# EAGLE board APM_v252_RELEASE (EAGLE 6.3)
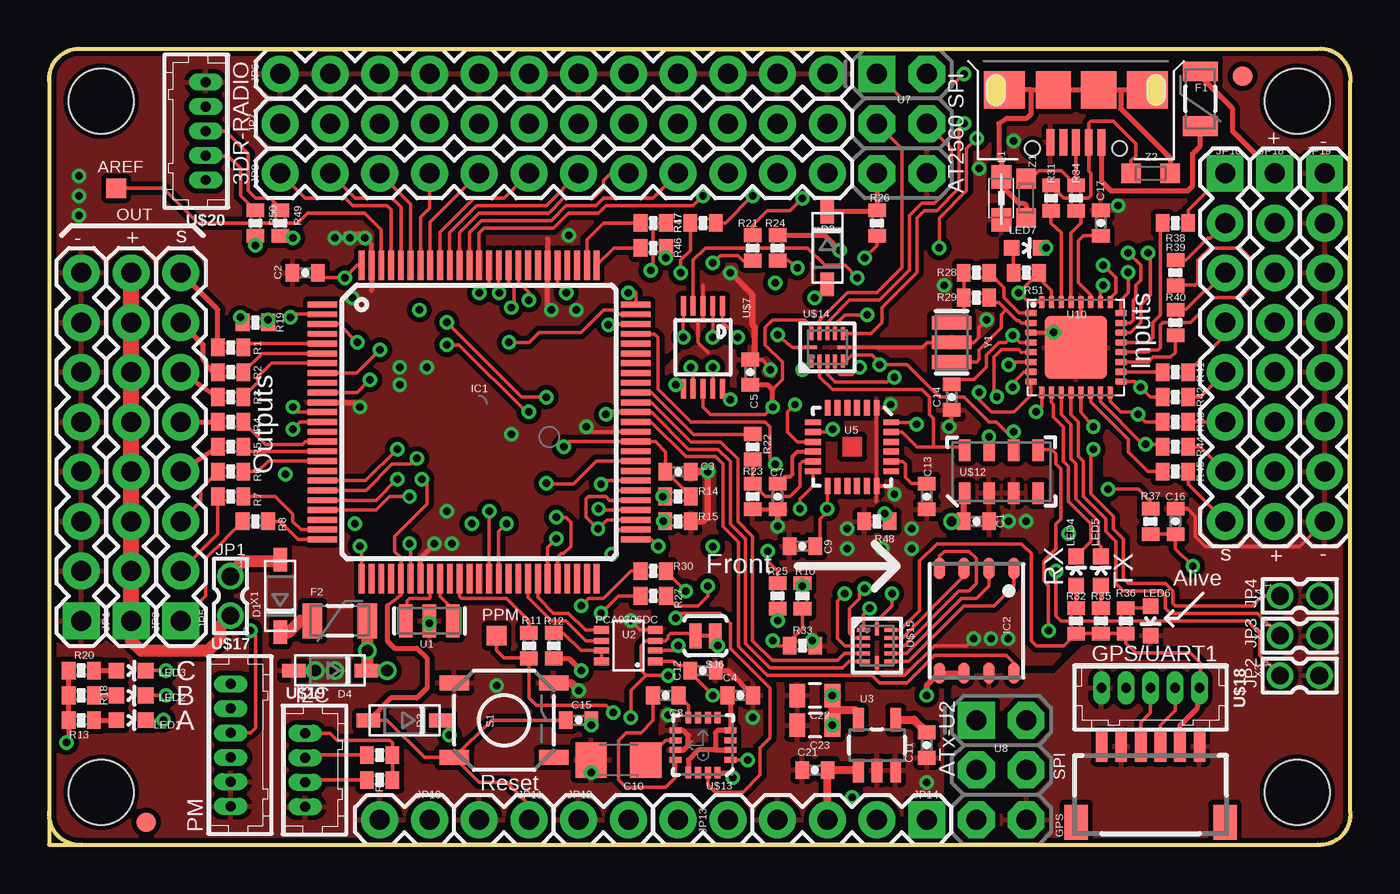
[diagram p1: board, top side]
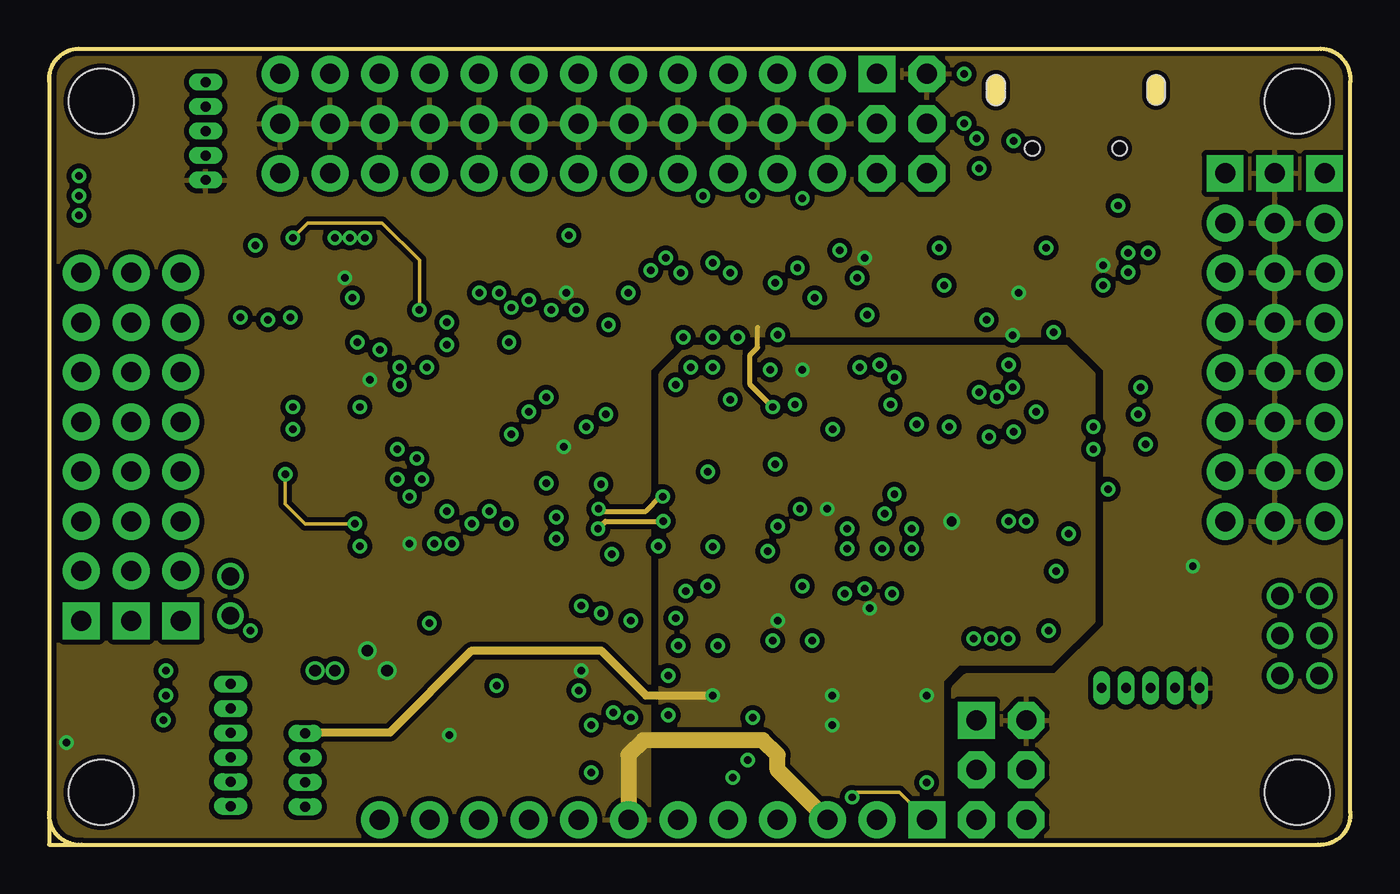
[diagram p2: board, inner layer Route2]
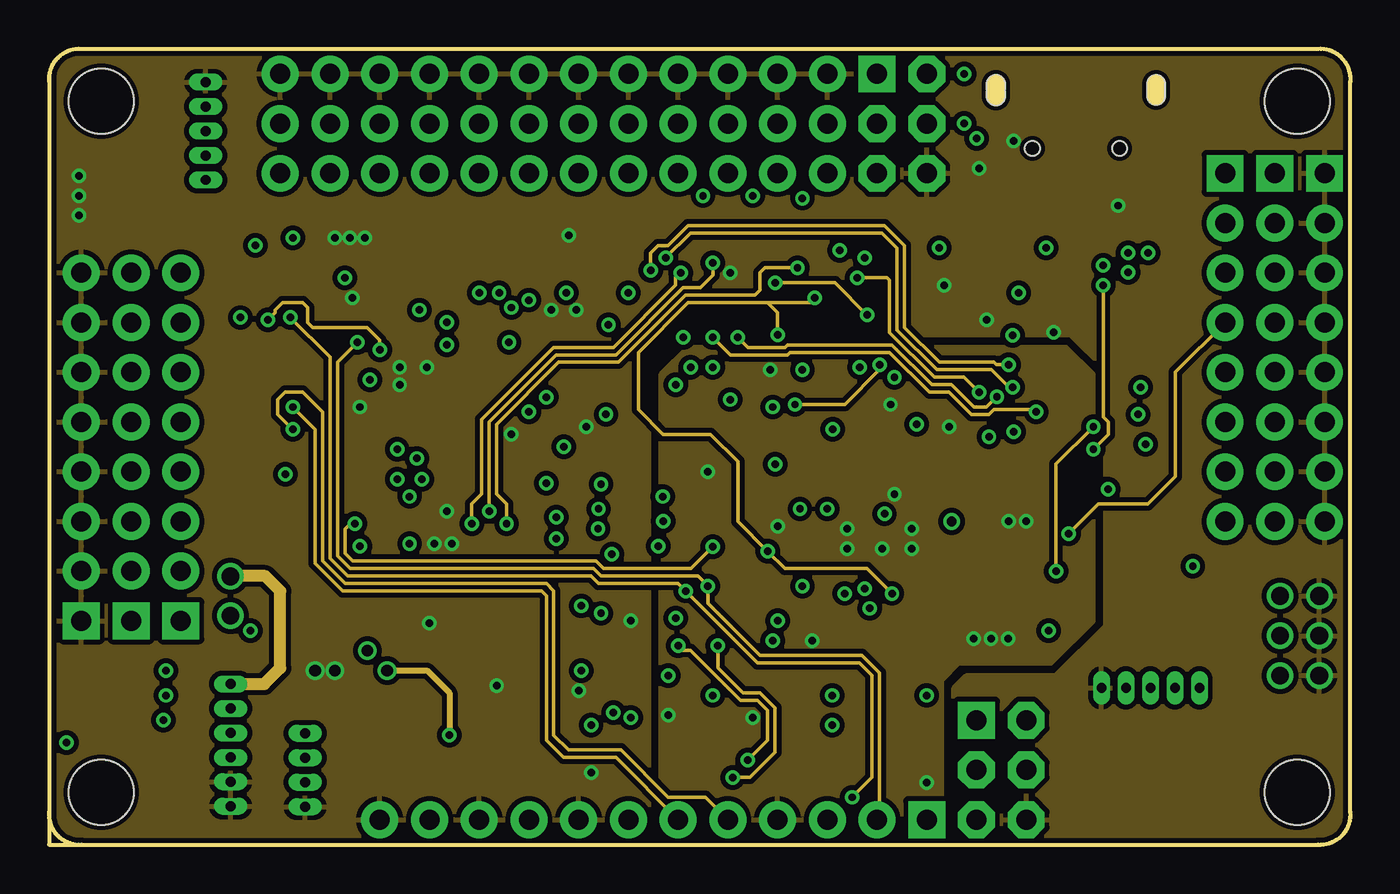
[diagram p3: board, inner layer Route15]
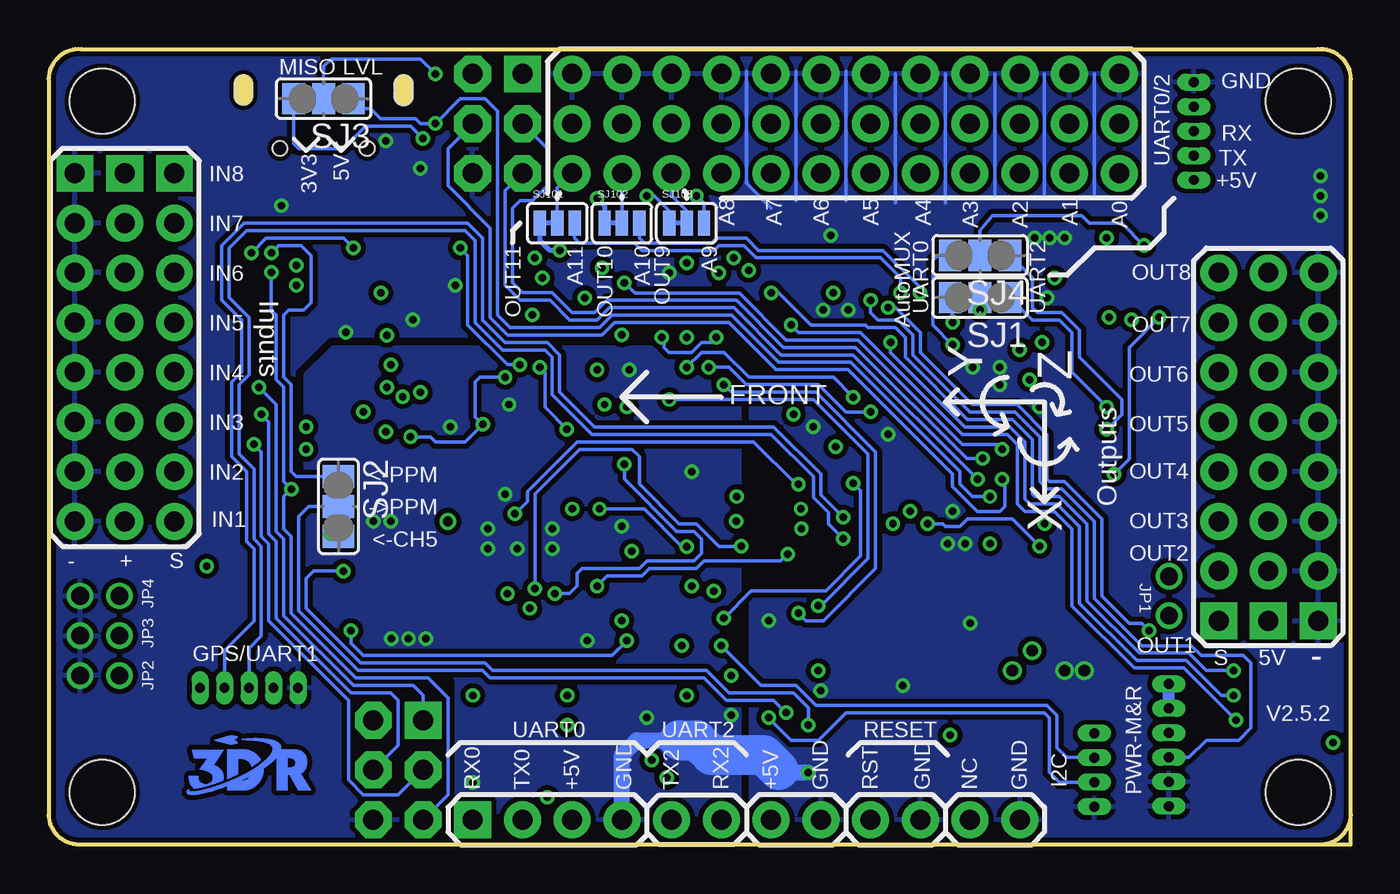
[diagram p4: board, bottom side, seen from below]

Size 66.48 x 40.65 mm. Coordinates in mm from the lower left corner, seen from the top.
Outline: 1.66,0 0,0 0,38.99
Outline: 1.66,0 64.83,0
Outline: 0,39.25 0,38.99
Outline: 1.4,40.64 64.83,40.64 arc-99 66.48,38.98 66.48,1.66 arc-99 64.82,0
Outline: 1.67,40.64 arc99 0,38.99
Outline: 0,1.67 arc99 1.66,0
Copper layers (1*2*15*16): Top 0.035mm / dielectric 0.5mm / Route2 0.035mm / dielectric 0.5mm / Route15 0.035mm / dielectric 0.5mm / Bottom 0.035mm
Design rules "default": minimum track width 7mil, minimum drill 10mil, track to track 7mil, track to pad 7mil, pad to pad 7mil, via to via 7mil, smd to smd 0mil, copper to edge 10mil, drill to drill 8mil, minimum pad ring 7mil, minimum via ring 7mil, stop-mask expansion 4mil, vias tented up to drill 25mil, thermal gap 10mil
Net classes: 0 default: width 0.178 mm, drill 0.381 mm, clearance 0.178 mm
Holes 0.9 mm at 48.37,38.87 48.37,38.23 48.37,38.43 48.37,38.66 56.55,38.87 56.55,38.26 56.55,38.46 56.55,38.66

## Footprints (pad centres in the part's own frame; a part is rotated, then mirrored left to right if it is on the bottom)
0402-CAP = smd 0.7 x 0.9: 1 -0.65,0; 2 0.65,0
1206 = smd 1.6 x 1.8: 1 -1.4,0; 2 1.4,0
0805 = smd 0.8 x 1.2: 1 -0.9,0; 2 0.9,0
SOD-123 = smd 1.2 x 0.7: A 1.85,0; C -1.85,0
PTC-1206 = smd 1 x 1.8: 1 -1.4,0; 2 1.4,0
SM06B-SRSS-TB = smd 0.6 x 1.55: 1 -2.5,2.975; 2 -1.5,2.975; 3 -0.5,2.975; 4 0.5,2.975; 5 1.5,2.975; 6 2.5,2.975 | smd 1.2 x 1.8: FIT@1 -3.8,-0.9; FIT@2 3.8,-0.9
TQFP100 = smd 1.5 x 0.3: 1 -8,6; 2 -8,5.5; 3 -8,5; 4 -8,4.5; 5 -8,4; 6 -8,3.5; 7 -8,3; 8 -8,2.5; 9 -8,2; 10 -8,1.5; 11 -8,1; 12 -8,0.5; 13 -8,0; 14 -8,-0.5; 15 -8,-1; 16 -8,-1.5; 17 -8,-2; 18 -8,-2.5; 19 -8,-3; 20 -8,-3.5; 21 -8,-4; 22 -8,-4.5; 23 -8,-5; 24 -8,-5.5; 25 -8,-6; 51 8,-6; 52 8,-5.5; 53 8,-5; 54 8,-4.5; 55 8,-4; 56 8,-3.5; 57 8,-3; 58 8,-2.5; 59 8,-2; 60 8,-1.5; 61 8,-1; 62 8,-0.5; 63 8,0; 64 8,0.5; 65 8,1; 66 8,1.5; 67 8,2; 68 8,2.5; 69 8,3; 70 8,3.5; 71 8,4; 72 8,4.5; 73 8,5; 74 8,5.5; 75 8,6 | smd 0.3 x 1.5: 26 -6,-8; 27 -5.5,-8; 28 -5,-8; 29 -4.5,-8; 30 -4,-8; 31 -3.5,-8; 32 -3,-8; 33 -2.5,-8; 34 -2,-8; 35 -1.5,-8; 36 -1,-8; 37 -0.5,-8; 38 0,-8; 39 0.5,-8; 40 1,-8; 41 1.5,-8; 42 2,-8; 43 2.5,-8; 44 3,-8; 45 3.5,-8; 46 4,-8; 47 4.5,-8; 48 5,-8; 49 5.5,-8; 50 6,-8; 76 6,8; 77 5.5,8; 78 5,8; 79 4.5,8; 80 4,8; 81 3.5,8; 82 3,8; 83 2.5,8; 84 2,8; 85 1.5,8; 86 1,8; 87 0.5,8; 88 0,8; 89 -0.5,8; 90 -1,8; 91 -1.5,8; 92 -2,8; 93 -2.5,8; 94 -3,8; 95 -3.5,8; 96 -4,8; 97 -4.5,8; 98 -5,8; 99 -5.5,8; 100 -6,8
VDFN-8-NO-BOTTOM-PAD = smd 1.1 x 0.6: 1 -2.675,1.905; 2 -2.675,0.635; 3 -2.675,-0.635; 4 -2.675,-1.905; 5 2.675,-1.905; 6 2.675,-0.635; 7 2.675,0.635; 8 2.675,1.905
1X08 = drill 1.016 pad 1.88 square: 1 0,0 | drill 1.016 pad 1.88: 2 2.54,0; 3 5.08,0; 4 7.62,0; 5 10.16,0; 6 12.7,0; 7 15.24,0; 8 17.78,0
FIDUCIAL-1X2 = smd 1 x 1: 1 0,0
1X12 = drill 1.016 pad 1.88: 1 0,0; 2 2.54,0; 3 5.08,0; 4 7.62,0; 5 10.16,0; 6 12.7,0; 7 15.24,0; 8 17.78,0; 9 20.32,0; 10 22.86,0; 11 25.4,0; 12 27.94,0
1X02 = drill 1.016 pad 1.88: 1 0,0; 2 2.54,0
1X04 = drill 1.016 pad 1.88 square: 1 0,0 | drill 1.016 pad 1.88: 2 2.54,0; 3 5.08,0; 4 7.62,0
0805' = smd 1.2 x 1: 1 -1.1,0; 2 1.1,0
LED-0603 = smd 0.8 x 0.8: A 0,-0.75; C 0,0.75
0402-RES = smd 0.7 x 0.9: 1 -0.65,0; 2 0.65,0
TACTILE_SWITCH_SMD = smd 1.524 x 0.762: 1 -2.54,1.905; 2 2.54,1.905; 3 -2.54,-1.905; 4 2.54,-1.905
SJ_2 = smd 1.168 x 1.6: 1 -1.524,0; 2 0,0; 3 1.524,0
SJ_2S-TRACE = smd 0.635 x 1.27: 1 -0.508,0; 2 0.508,0
SJ_3 = smd 0.635 x 1.27: 1 -0.889,0; 2 0,0; 3 0.889,0
TP10SQ = smd 1 x 1: TP 0,0
RESONATOR-SMD = smd 0.7 x 1.7: 1 -1.2,0; 2 0,0; 3 1.2,0
VSSOP8 = smd 0.75 x 0.4: 1 -1.375,0.8; 4 -1.375,-0.8; 5 1.375,-0.8; 8 1.375,0.8 | smd 0.75 x 0.3: 2 -1.375,0.25; 3 -1.375,-0.25; 6 1.375,-0.25; 7 1.375,0.25
SOT23-5 = smd 0.55 x 1.2: 1 -0.95,-1.3; 2 0,-1.3; 3 0.95,-1.3; 4 0.95,1.3; 5 -0.95,1.3
QFN-24 = smd 0.8 x 0.3: 1 -2,1.25; 2 -2,0.75; 3 -2,0.25; 4 -2,-0.25; 5 -2,-0.75; 6 -2,-1.25; 13 2,-1.25; 14 2,-0.75; 15 2,-0.25; 16 2,0.25; 17 2,0.75; 18 2,1.25 | smd 0.3 x 0.8: 7 -1.25,-2; 8 -0.75,-2; 9 -0.25,-2; 10 0.25,-2; 11 0.75,-2; 12 1.25,-2; 19 1.25,2; 20 0.75,2; 21 0.25,2; 22 -0.25,2; 23 -0.75,2; 24 -1.25,2
2X3-NS = drill 1.016 pad 1.88 square: 1 -2.54,-1.27 | drill 1.016 pad 1.88 octagon: 2 -2.54,1.27; 3 0,-1.27; 4 0,1.27; 5 2.54,-1.27; 6 2.54,1.27
MOLEX_MICRO_USB_AB_BOTTOM_MOUNT = smd 0.4 x 1.35: 1 1.3,-4.125; 2 0.65,-4.125; 3 0,-4.125; 4 -0.65,-4.125; 5 -1.3,-4.125 | smd 2.1 x 1.9: GND1 3.65,-1.452; GND4 -3.65,-1.452 | smd 1.8 x 1.9: GND2 1.151,-1.452; GND3 -1.149,-1.452 | hole 0.75: -2.225,-4.45; 2.225,-4.45
QFN32 = smd 0.6 x 0.3: 1 -2.3,1.75; 2 -2.3,1.25; 3 -2.3,0.75; 4 -2.3,0.25; 5 -2.3,-0.25; 6 -2.3,-0.75; 7 -2.3,-1.25; 8 -2.3,-1.75; 17 2.3,-1.75; 18 2.3,-1.25; 19 2.3,-0.75; 20 2.3,-0.25; 21 2.3,0.25; 22 2.3,0.75; 23 2.3,1.25; 24 2.3,1.75 | smd 0.3 x 0.6: 9 -1.75,-2.3; 10 -1.25,-2.3; 11 -0.75,-2.3; 12 -0.25,-2.3; 13 0.25,-2.3; 14 0.75,-2.3; 15 1.25,-2.3; 16 1.75,-2.3; 25 1.75,2.3; 26 1.25,2.3; 27 0.75,2.3; 28 0.25,2.3; 29 -0.25,2.3; 30 -0.75,2.3; 31 -1.25,2.3; 32 -1.75,2.3 | smd 3.2 x 3.2: EXP 0,0
STAND-OFF = hole 3.302: 0,0
MSOP10 = smd 0.25 x 1: 1 -1,-2.113; 2 -0.5,-2.113; 3 0,-2.113; 4 0.5,-2.113; 5 1,-2.113; 6 1,2.113; 7 0.5,2.113; 8 0,2.113; 9 -0.5,2.113; 10 -1,2.113
MS5611-01BA = smd 1.1 x 0.6: 1 -1.1,1.875; 2 -1.1,0.625; 3 -1.1,-0.625; 4 -1.1,-1.875; 5 1.1,-1.875; 6 1.1,-0.625; 7 1.1,0.625; 8 1.1,1.875
LPCC16 = smd 0.6 x 0.3: 1 -1.4,0.75; 2 -1.4,0.25; 3 -1.4,-0.25; 4 -1.4,-0.75; 9 1.4,-0.75; 10 1.4,-0.25; 11 1.4,0.25; 12 1.4,0.75 | smd 0.3 x 0.6: 5 -0.75,-1.4; 6 -0.25,-1.4; 7 0.25,-1.4; 8 0.75,-1.4; 13 0.75,1.4; 14 0.25,1.4; 15 -0.25,1.4; 16 -0.75,1.4
UQFN-12 = smd 0.2 x 0.65: 1 -0.8,-0.7; 2 -0.4,-0.7; 3 0,-0.7; 4 0.4,-0.7; 5 0.8,-0.7; 7 0.8,0.7; 8 0.4,0.7; 9 0,0.7; 10 -0.4,0.7; 11 -0.8,0.7 | smd 0.65 x 0.2: 6 0.85,0; 12 -0.85,0
DF13-6P-1.25DSA = drill 0.5 pad 0.8 long: 1 -3.125,0; 2 -1.875,0; 3 -0.625,0; 4 0.625,0; 5 1.875,0; 6 3.125,0
DF13-5P-1.25DSA = drill 0.5 pad 0.8 long: 1 -2.5,0; 2 -1.25,0; 3 0,0; 4 1.25,0; 5 2.5,0
DF13-4P-1.25DSA = drill 0.5 pad 0.8 long: 1 -1.875,0; 2 -0.625,0; 3 0.625,0; 4 1.875,0
87758-0216 = drill 0.9 pad 1.27: 1 0,-1; 2 0,1
RESONATOR = smd 0.7 x 2: 1 -1,0; 2 0,0; 3 1,0
CT/CN0603 = smd 1 x 1: 1 -1,0; 2 1,0

## Placement (x,y rotation side)
C1  .1uF  [0402-CAP]  47.38,16.51 180 top
C2  .1uF  [0402-CAP]  13.09,29.21 180 top
C3  .1uF  [0402-CAP]  32.14,19.05 0 top
C4  0.1uF  [0402-CAP]  35.31,7.62 0 top
C5  .1uF  [0402-CAP]  35.82,24.13 270 top
C7  .1uF  [0402-CAP]  37.22,17.78 90 top
C8  0.22uF  [0402-CAP]  31.5,7.62 180 top
C9  .1uF  [0402-CAP]  38.49,15.24 0 top
C10  4.7uF  [1206]  29.09,4.32 180 top
C11  .01uF  [0402-CAP]  44.84,5.08 90 top
C12  .1uF  [0402-CAP]  33.41,8.89 180 top
C13  .01uF  [0402-CAP]  44.84,17.78 90 top
C14  .1uF  [0402-CAP]  46.11,22.86 270 top
C15  .1uF  [0402-CAP]  27.06,6.35 180 top
C16  .1uF  [0402-CAP]  57.54,16.51 90 top
C17  1uF  [0402-CAP]  53.73,31.75 90 top
C21  .1uF  [0402-CAP]  39.12,3.81 0 top
C22  4.7uF  [0805]  39.12,7.62 180 top
C23  4.7uF  [0805]  39.12,6.1 180 top
D1  MBR120VLSFT1G  [SOD-123]  11.82,12.7 90 top
D2  MBR120VLSFT1G  [SOD-123]  39.76,30.48 270 top
D3  MBR120VLSFT1G  [SOD-123]  18.17,6.35 180 top
D4  MMSZ5233BT1G  [SOD-123]  14.36,8.89 180 top
F1  500mA  [PTC-1206]  58.81,38.1 90 top
F2  500mA  [PTC-1206]  14.86,11.43 0 top
GPS  SM06B-SRSS-TB  [SM06B-SRSS-TB]  56.27,2.04 0 top
IC1  ATMEGA2560-16AU  [TQFP100]  21.98,21.59 0 top
IC2  AT45DB161D-MU  [VDFN-8-NO-BOTTOM-PAD]  47.38,11.43 270 top
JP1  GND  [1X08]  1.66,11.43 90 top
JP2  FIDUCIAL1X2  [FIDUCIAL-1X2]  4.96,1.15 0 top
JP3  5V  [1X08]  4.2,11.43 90 top
JP5  OUT PWM  [1X08]  6.74,11.43 90 top
JP6  GND  [1X12]  11.82,39.37 0 top
JP7  5V  [1X12]  11.82,36.83 0 top
JP8  IO pins  [1X12]  11.82,34.29 0 top
JP10  3v3  [1X02]  19.44,1.27 180 top
JP11  RST  [1X02]  24.52,1.27 180 top
JP12  VCC  [1X02]  27.06,1.27 0 top
JP13  UART2  [1X02]  34.68,1.27 180 top
JP14  UART0  [1X04]  44.84,1.27 180 top
JP16  IN PWM  [1X08]  60.08,34.29 270 top
JP17  FIDUCIAL1X2  [FIDUCIAL-1X2]  60.96,39.25 0 top
JP18  5V  [1X08]  62.62,34.29 270 top
JP19  GND  [1X08]  65.16,34.29 270 top
L1  BLM21  [0805']  48.65,33.02 90 top
LED1  RED  [LED-0603]  4.2,6.35 270 top
LED2  YELLOW  [LED-0603]  4.2,7.62 270 top
LED3  BLUE  [LED-0603]  4.2,8.89 270 top
LED4  ORANGE  [LED-0603]  52.46,13.97 0 top
LED5  ORANGE  [LED-0603]  53.73,13.97 0 top
LED6  GRN  [LED-0603]  56.27,11.43 180 top
LED7  RED  [LED-0603]  49.92,30.48 270 top
R1  220  [0402-RES]  9.28,25.4 0 top
R2  220  [0402-RES]  9.28,24.13 0 top
R3  220  [0402-RES]  9.28,22.86 0 top
R4  220  [0402-RES]  9.28,21.59 0 top
R5  220  [0402-RES]  9.28,20.32 0 top
R6  220  [0402-RES]  9.28,19.05 0 top
R7  220  [0402-RES]  9.28,17.78 0 top
R8  220  [0402-RES]  10.55,16.51 0 top
R9  2.2k  [0402-RES]  16.9,4.58 0 top
R10  4.7K  [0402-RES]  38.49,12.7 90 top
R11  1K  [0402-RES]  24.52,10.16 270 top
R12  200k  [0402-RES]  25.79,10.16 270 top
R13  1k  [0402-RES]  1.66,6.35 180 top
R14  10K  [0402-RES]  32.14,17.78 180 top
R15  10K  [0402-RES]  32.14,16.51 180 top
R16  2.2k  [0402-RES]  16.9,3.31 0 top
R17  1k  [0402-RES]  33.41,31.75 0 top
R18  1k  [0402-RES]  1.66,7.62 180 top
R19  220  [0402-RES]  10.55,26.67 0 top
R20  1k  [0402-RES]  1.66,8.89 180 top
R21  1k  [0402-RES]  35.95,30.48 90 top
R22  4.7K  [0402-RES]  35.95,20.32 90 top
R23  10k  [0402-RES]  35.95,17.78 270 top
R24  1k  [0402-RES]  37.22,30.48 90 top
R25  10k  [0402-RES]  37.22,12.7 90 top
R26  10k  [0402-RES]  42.3,31.75 270 top
R27  1k  [0402-RES]  30.87,12.7 180 top
R28  27  [0402-RES]  47.38,29.21 0 top
R29  1M  [0402-RES]  47.38,27.94 180 top
R30  1k  [0402-RES]  30.87,13.97 180 top
R31  22  [0402-RES]  51.19,33.02 90 top
R32  1k  [0402-RES]  52.46,11.43 90 top
R33  10k  [0402-RES]  38.49,10.16 0 top
R34  22  [0402-RES]  52.46,33.02 90 top
R35  1k  [0402-RES]  53.73,11.43 90 top
R36  1k  [0402-RES]  55,11.43 270 top
R37  10K  [0402-RES]  56.27,16.51 270 top
R38  220  [0402-RES]  57.54,31.75 180 top
R39  220  [0402-RES]  57.54,29.21 270 top
R40  220  [0402-RES]  57.54,26.67 270 top
R41  220  [0402-RES]  57.54,24.13 180 top
R42  220  [0402-RES]  57.54,22.86 180 top
R43  220  [0402-RES]  57.54,21.59 180 top
R44  220  [0402-RES]  57.54,20.32 180 top
R45  220  [0402-RES]  57.54,19.05 180 top
R46  1k  [0402-RES]  30.87,30.48 0 top
R47  1k  [0402-RES]  30.87,31.75 0 top
R48  10k  [0402-RES]  42.3,16.51 180 top
R49  1k  [0402-RES]  11.82,31.75 270 top
R50  1k  [0402-RES]  10.55,31.75 270 top
R51  1k  [0402-RES]  49.92,29.21 180 top
S1  [TACTILE_SWITCH_SMD]  23.25,6.35 0 top
SJ1  [SJ_2]  18.93,27.94 180 bottom
SJ2  [SJ_2]  51.69,17.28 270 bottom
SJ3  [SJ_2]  52.46,38.1 180 bottom
SJ4  [SJ_2]  18.93,30.1 180 bottom
SJ6  MAG  [SJ_2S-TRACE]  33.53,10.67 180 top
SJ101  [SJ_3]  40.52,31.75 0 bottom
SJ102  [SJ_3]  37.22,31.75 0 bottom
SJ103  [SJ_3]  33.91,31.75 0 bottom
TP1  TPSQTP10SQ  [TP10SQ]  3.43,33.53 0 top
TP2  TPSQTP10SQ  [TP10SQ]  22.86,10.67 0 top
U1  16MHZ  [RESONATOR-SMD]  19.44,11.43 0 top
U2  PCA9306DC  [VSSOP8]  29.6,10.16 180 top
U3  TPS79133  [SOT23-5]  42.3,5.08 0 top
U5  MPU-6000  [QFN-24]  41.03,20.32 270 top
U7  SPI_Mega  [2X3-NS]  43.57,36.83 270 top
U8  SPI_PPM  [2X3-NS]  48.65,3.81 270 top
U9  USB  [MOLEX_MICRO_USB_AB_BOTTOM_MOUNT]  52.46,40.01 0 top
U10  ATMEGA32U2-MU  [QFN32]  52.46,25.4 0 top
U$1  STAND-OFF  [STAND-OFF]  2.67,37.98 0 top
U$2  STAND-OFF  [STAND-OFF]  2.67,2.67 0 top
U$4  STAND-OFF  [STAND-OFF]  63.76,37.98 0 top
U$5  STAND-OFF  [STAND-OFF]  63.76,2.67 0 top
U$6  CREATIVE_COMMONS  [CREATIVE_COMMONS]  64.65,-8.38 180 top  (outside the outline)
U$7  TS5A23157  [MSOP10]  33.41,25.4 180 top
U$12  MS5611-01BA  [MS5611-01BA]  48.65,19.05 90 top
U$13  HMC5883L  [LPCC16]  33.41,5.08 180 top
U$14  TXB0104UQFN  [UQFN-12]  39.76,25.4 0 top
U$15  TXB0104UQFN  [UQFN-12]  42.3,10.16 270 top
U$17  DF13-6P-1.25DSA  [DF13-6P-1.25DSA]  9.28,5.08 270 top
U$18  DF13-5P-1.25DSA  [DF13-5P-1.25DSA]  56.27,8.01 180 top
U$19  DF13-4P-1.25DSA  [DF13-4P-1.25DSA]  13.09,3.81 270 top
U$20  DF13-5P-1.25DSA  [DF13-5P-1.25DSA]  8.01,36.45 90 top
U$21  [3DR-LOGO-025IN-METAL]  56.27,3.81 0 bottom
X1  ESC 5V EN  [87758-0216]  9.28,12.7 180 top
X2  PPM_PD6  [87758-0216]  63.89,10.67 270 top
X3  HWB  [87758-0216]  63.89,8.64 270 top
X4  PPM_PC4  [87758-0216]  63.89,12.7 270 top
Y1  16MHz  [RESONATOR]  46.11,25.66 90 top
Z1  PGB1010604  [CT/CN0603]  49.92,33.02 270 top
Z2  PGB1010604  [CT/CN0603]  56.27,34.29 0 top

## Tracks (layer width: path | path; a pad name or v marks a point on that pad's centre or on a via)
3.3V  (via drill 0.38, 0.5)
  Top 0.178: U2.1 31.92,9.36 32.14,9.15 32.5,9.15 C12.2 32.76,8.78 v33.91,7.62 | U5.13 39.78,17.26 v39.76,17.15 | v39.76,17.15 39.76,17.02 39.37,16.64 39.37,15.5 39.11,15.23 C9.2 | v37.22,11.43 R25.1 | v39.76,17.15 39.74,17.15 | U$14.1 38.93,24.7 v38.49,24.26 | U$15.1 41.6,11.75 v41.91,12.07 | R16.2 R9.2 17.55,5.2 17.4,5.34 14.71,5.34 14.36,5.69 U$19.1
  Top 0.254: v33.91,7.62 C4.1 34.81,7.48 U$13.4 34.16,5.83 34.04,5.72 34.04,4.83 | 34.04,4.83 33.16,4.83 32.66,4.33 U$13.13 | 34.04,4.83 U$13.2
  Top 0.305: U$12.1 46.73,17.91 C1.2 | v44.84,7.62 44.84,8.12 IC2.5 IC2.6
  Top 0.406: v46.11,16.51 C1.2 | 40.02,6.99 C23.1 v40.01,6.1 | 40.02,6.99 C22.1 | 40.02,6.99 40.05,7.02 40.05,6.95 40.14,6.86 41.19,6.86 41.35,6.71 U3.5
  Route2 0.406: v33.91,7.62 30.48,7.62 28.2,9.91 21.59,9.91 17.4,5.72 13.12,5.72 U$19.1
  other vias: 40.01,7.62
  pour Route2 (isolate 0.254): 45.6,-4.44 45.6,8.39 46.49,9.28 51.19,9.28 53.34,11.43 53.34,24.01 51.95,25.4 32.64,25.4 31.25,24.01 31.25,-4.44
5V
  Top 0.254: 4.32,12.7 4.2,12.83
  Top 0.61: JP3.1 4.2,10.42 4.7,9.91 8.13,9.91 8.77,10.55 8.77,11.2 X1.2
  Top 0.813: JP3.1 4.2,12.83 JP3.2 JP3.3 JP3.4 JP3.5 JP3.6 JP3.7 JP3.8
#RST  (via drill 0.38)
  Top 0.178: U10.13 52.71,22.11 v53.34,21.34 | v51.44,13.97 51.44,11.69 51.69,11.43 61.22,11.43 61.85,10.8 61.85,9.67 X3.1
  Top 0.406: C15.1 27.71,6.12 v27.69,6.1
  Route15 0.178: v53.34,21.34 51.44,19.44 v51.44,13.97
  Bottom 0.178: v27.69,6.1 27.69,6.99 28.45,7.75 31.75,7.75 32.9,8.89 43.82,8.89 44.2,9.28 50.55,9.28 53.34,12.07 53.34,13.59 52.96,13.97 v51.44,13.97
AREF
  Top 0.178: IC1.98 16.98,31.42 16.13,32.26 13.21,32.26 12.7,31.75 7.62,31.75 5.85,33.53 TP1.TP
CH1
  Top 0.178: R45.1 58.19,18.4 JP16.8
CH5  (via drill 0.38)
  Top 0.178: JP16.4 60.08,26.04 58.19,24.15 R41.1
  Route15 0.178: JP16.4 57.54,24.13 57.54,18.8 56.14,17.4 53.6,17.4 v52.07,15.88
  Bottom 0.178: SJ2.3 52.2,15.75 v52.07,15.88
CH8
  Top 0.178: JP16.1 58.19,32.4 R38.1
CS_DF
  Top 0.178: U$15.9 43.69,10.16 46.49,12.96 46.99,12.96 47.38,13.34 47.38,14.61 46.99,14.99 45.72,14.99 45.47,14.74 IC2.4
CS_MS5611  (via drill 0.38)
  Top 0.178: U$12.5 50.55,20.18 51.2,20.18 51.44,19.94 51.44,19.44 51.69,19.18 51.69,16.64 51.44,16.39 51.44,15.12 50.8,14.48 50.8,13.47 51.06,13.21 v51.06,10.93 | 38.5,12.07 R10.1 38.49,11.05 37.85,10.42 R33.1 37.22,10.16 v36.96,10.42
  Bottom 0.178: v51.06,10.93 51.06,10.29 50.42,9.66 37.72,9.66 v36.96,10.42
D+
  Top 0.178: Z1.1 50.15,34.02 50.55,34.42 51.71,34.42 R34.2 U9.3
D-
  Top 0.178: R31.2 51.84,33.02 53.09,33.02 53.22,33.15 53.22,34.29 53.11,34.41 U9.2 53.11,36.85 53.22,36.96 54.36,36.96 55.5,35.82 55.5,35.18 55.27,34.95 Z2.1
FSYNC
  Top 0.178: U5.11 38.5,19.57 38.36,19.44 38.36,18.29 37.85,17.78 36.6,17.78 R23.1 R22.1
GND  (via drill 0.38, 0.6)
  Top 0.178: IC1.62 27.69,21.09 v27.44,21.34 | U10.3 v51.32,26.15 | 51.95,25.91 51.71,26.15 v51.32,26.15 | 51.95,25.91 U10.EXP | v51.32,26.15 v51.31,26.17 | U1.2 v19.44,11.31 | U5.1 U5.18 42.77,18.32 v43.18,17.91 | R23.2 C7.1 | C16.2 58.16,17.16 58.55,16.77 58.55,15.75 59.06,15.24 63.89,15.24 JP19.8 | C5.1 36.44,24.78 v36.83,24.26 | U$7.3 33.41,26.93 33.15,26.67 33.15,25.66 33.66,25.15 | 16.48,30.65 v16.13,30.99 15.88,31.25 15.12,31.25 | C14.2 46.11,21.59 v45.98,21.34 | U2.4 30.19,10.96 v29.72,11.43 | U$15.6 42.3,8.89 42.55,8.64 43.69,8.64 45.22,10.16 46.87,10.16 47.25,10.55 | U$14.6 44.58,25.4 44.84,25.66 Y1.2 47.25,25.66 47.5,25.91 47.5,26.42 v47.88,26.8 47.76,26.67 | R33.2 39.14,10.28 v38.99,10.42 | U10.28 52.71,26.67 51.95,25.91 | 33.41,27.69 33.41,28.58 | 42.27,18.24 42.27,17.56 42.24,17.53
  Top 0.254: IC1.11 15.61,22.59 v15.88,22.36 | IC1.81 25.48,27.49 v25.66,27.31 | IC1.62 | 16.48,30.65 IC1.99 16.48,28.32 | C4.2 34.68,8.89 C12.1 | U$13.11 32.39,4.83 32.64,5.08 32.64,5.59 32.4,5.83 U$13.9 | IC1.32 18.98,14.66 v19.69,15.37 | IC1.81 25.48,30.94
  Top 0.305: C7.1 v37.22,16.26 | R15.1 33.41,16.51 33.66,16.77 v33.66,19.05 | v34.8,29.21 35.95,28.07 35.95,26.55 36.07,26.42 36.07,25.04 C5.1
  Top 0.406: C3.2 33.14,19.04 v33.66,19.05 | S1.2 26.67,8.26 v27.06,7.88
  Bottom 0.178: 13.09,33.02 13.09,39.37 | 15.63,33.02 15.63,39.37 | 18.17,33.02 18.17,39.37 | 20.71,32.77 20.71,39.37 | 23.25,32.77 23.25,39.37 | 25.79,32.9 25.79,39.5 | 28.33,32.9 28.33,39.5 | 30.87,39.5 30.87,33.79 29.6,32.52
  Bottom 0.813: JP14.4 37.22,4.58 36.45,5.34 34.29,5.34 | 28.71,3.69 v27.69,3.69
  Bottom 2.032: 34.29,5.34 33.41,5.34 32.64,4.58 29.98,4.58 29.21,3.81
  other vias: 19.31,24.39 22.86,8.13 23.63,20.96 47.5,34.55 45.72,28.58 17.91,24.39 17.91,23.5 20.32,17.02 15.5,27.94 1.53,33.15 1.53,32.14 1.53,34.17 49.03,16.51 31.63,6.61 35.95,6.48 49.28,35.95 54.61,32.64 13.59,8.89 14.61,8.89 49.92,16.51 44.07,16.13 44.07,15.12 42.55,15.12 40.77,15.12 40.77,16.13 42.98,22.48 15.37,30.99 14.61,30.99 20.58,15.37 26.93,27.31 26.55,31.12 48.11,10.52 49,10.52 47.22,10.52 44.84,3.18
  pour Top (isolate 0.254): 14.74,28.96 29.21,28.83 29.21,14.23 14.74,14.36
  pour Route15 (isolate 0.254): 0,0 0,41.53 67.7,41.53 67.7,0 46.23,0 46.23,8.01 46.87,8.64 51.44,8.64 53.98,11.18 53.98,24.26 52.2,26.04 32.39,26.04 30.61,24.26 30.61,0
  pour Route15 (isolate 0.254): 45.6,-1.39 45.6,8.39 46.49,9.28 51.19,9.28 53.34,11.43 53.34,24.01 51.95,25.4 32.64,25.4 31.25,24.01 31.25,-1.39
  pour Top (isolate 0.254): 0,0 0,42.68 68.97,42.68 68.97,0 46.23,0 46.23,8.01 46.87,8.64 51.44,8.64 53.98,11.18 53.98,24.26 52.2,26.04 32.39,26.04 30.61,24.26 30.61,0
  pour Top (isolate 0.254): 45.6,-2.41 45.6,8.39 46.49,9.28 51.19,9.28 53.34,11.43 53.34,24.01 51.95,25.4 32.64,25.4 31.25,24.01 31.25,-2.41
  pour Bottom (isolate 0.254): 0,0 0,43.82 70.36,43.82 70.36,0 46.23,0 46.23,8.01 46.87,8.64 51.44,8.64 53.98,11.18 53.98,24.26 52.2,26.04 32.39,26.04 30.61,24.26 30.61,0
  pour Bottom (isolate 0.254): 45.6,-3.42 45.6,8.39 46.49,9.28 51.19,9.28 53.34,11.43 53.34,24.01 51.95,25.4 32.64,25.4 31.25,24.01 31.25,-3.42
HI  (via drill 0.38)
  Top 0.178: IC1.54 28.13,17.09 v28.07,17.15
  Top 0.254: v31.36,17.78 R14.2
  Route2 0.254: v31.36,17.78 31.25,17.78 30.48,17.02 28.2,17.02 v28.07,17.15
IN0
  Top 0.178: 53.21,22.62 U10.14 53.22,23.09 53.22,22.61 55.12,20.71 55.12,20.07 56.14,19.05 R45.2
IN4
  Top 0.178: U10.18 56.87,24.15 R41.2
IN5
  Top 0.178: R40.2 57.54,25.15 57.28,24.9 56.39,24.9 56.15,24.65 U10.19
IN6
  Top 0.178: 57.52,28.58 R39.2 57.55,28.58 58.55,28.58 58.68,28.71 58.68,29.85 59.31,30.48 60.84,30.48 61.35,29.98 61.35,28.45 60.84,27.94 59.44,27.94 58.81,27.31 58.81,27.18 58.3,26.67 56.9,26.67 56.77,26.55 56.77,25.4 56.65,25.28 56.27,25.28 56.14,25.15 U10.20
IN7
  Top 0.178: U10.21 56.13,25.65 56.39,25.91 56.39,26.67 56.77,27.06 56.77,31.64 R38.2
INT  (via drill 0.38)
  Top 0.178: v38.36,17.15 38.36,17.66 39.03,18.33 U5.12 | R19.1 9.9,26.82 v9.78,26.93
  Route2 0.178: v12.07,18.93 12.07,17.4 13.09,16.39 v15.63,16.39
  Route15 0.178: v33.91,15.23 32.79,14.1 28.33,14.1 27.94,14.48 15.5,14.48 15.12,14.86 15.12,16.13 15.37,16.39 v15.63,16.39
  Bottom 0.178: v38.36,17.15 36.07,17.15 34.17,15.24 v33.91,15.23 | v9.78,26.93 11.31,25.4 11.31,19.69 v12.07,18.93
JP_RX  (via drill 0.38)
  Top 0.178: v12.45,30.99 11.93,30.99 R49.2
  Route2 0.178: v18.93,27.31 18.93,29.85 17.02,31.75 13.21,31.75 v12.45,30.99
  Bottom 0.178: SJ1.2 v18.93,27.31
JP_TX  (via drill 0.38)
  Top 0.178: v10.55,30.61 R50.2
  Bottom 0.178: v10.55,30.61 11.69,31.75 13.34,31.75 13.72,32.14 18.29,32.14 18.93,31.37 SJ4.2
JP_VCC
  Top 0.406: 11.76,14.61 D1.A
  Top 0.61: X1.1 9.28,13.85 9.91,14.48 11.74,14.48 D1.A
  Route15 0.61: U$17.1 11,8.21 11.82,9.02 11.82,12.96 11.05,13.72 9.29,13.72 X1.1
  Bottom 0.61: U$17.2 U$17.1
LO  (via drill 0.38)
  Top 0.178: IC1.56 29.02,18.09 28.96,18.04 28.96,17.66 29.01,17.61 29.96,17.61 IC1.55 28.64,17.59 28.45,17.78 27.56,17.78 27.44,17.66 27.44,16.74 v28.05,16.13 28.51,16.59 IC1.53
  Top 0.254: v31.37,16.51 R15.2
  Route2 0.254: v28.05,16.13 28.43,16.51 v31.37,16.51
MISO_3V3  (via drill 0.38)
  Top 0.178: 49.27,21.08 U$12.6 | v49.28,21.09 49.27,21.08 | U5.9 38.24,20.57 37.72,21.09 37.72,22.1 v38.1,22.48 | U$14.5 40.71,24.7 41.03,25.02 42.04,25.02 42.42,24.64 v42.42,24.52 43.82,24.52 45.47,22.86 46.74,22.86 48.01,21.59 48.39,21.59 48.91,21.08 49.27,21.08 | v45.47,30.48 45.47,32.01 46.87,33.41 46.87,35.56 v47.38,36.07
  Route15 0.178: v38.1,22.48 40.64,22.48 42.42,24.26 v42.42,24.52
  Bottom 0.178: v42.42,24.52 43.06,24.52 45.09,26.55 45.09,30.1 v45.47,30.48 | v47.38,36.07 48.01,36.71 50.3,36.71 51.44,35.56 53.73,35.56 53.98,35.82 SJ3.3
MOSI_3V3  (via drill 0.38)
  Top 0.178: U$12.7 48.02,20.82 v48.01,20.83 | U5.24 44.22,21.57 v44.33,21.47 | U$14.3 39.76,24.01 40.14,23.63 42.8,23.63 v43.18,23.88
  Bottom 0.178: v48.01,20.83 46.99,20.83 46.74,20.58 45.22,20.58 v44.33,21.47 44.71,21.85 44.71,23.63 44.45,23.88 v43.18,23.88
MOSI_DF
  Top 0.178: U$15.7 43.91,9.36 46.74,12.2 48.26,12.2 49.28,13.21 IC2.1
MUX_RX  (via drill 0.38)
  Top 0.178: U$7.9 v33.91,24.38 v33.91,24.39 | v25.4,22.86 24.13,22.86 v20.32,26.67
  Bottom 0.178: v33.91,24.39 33.15,25.15 32.01,25.15 30.74,23.88 26.42,23.88 v25.4,22.86 | v20.32,26.67 20.32,27.82 SJ1.3
MUX_TX  (via drill 0.38)
  Top 0.178: U$7.7 32.91,24.25 v32.77,24.39 | v24.52,22.1 24.39,22.1 20.96,25.53 v20.32,25.53
  Bottom 0.178: v32.77,24.39 31.75,24.39 30.87,23.5 27.18,23.5 25.79,22.1 v24.52,22.1 | v20.32,25.53 21.34,26.55 21.34,29.85 21.09,30.1 SJ4.3 19.05,30.1
N$1
  Top 0.178: R36.1 56.17,12.08 LED6.A
N$2
  Top 0.178: U5.20 43.6,19.57 43.74,19.44 43.74,18.75 44.05,18.44 C13.2
N$3
  Top 0.203: U5.10 38.24,20.07 37.98,19.82 37.98,18.93 37.85,18.8 37.59,18.8 C7.2
N$5
  Top 0.61: D1.C 12.25,10.85 12.83,11.43 F2.1
N$6
  Top 0.406: U3.4 44.19,6.38 C11.2
N$7
  Top 0.178: U$13.10 31.5,5.33 C10.1
N$8
  Top 0.254: JP5.5 R4.1
N$9
  Top 0.254: JP5.6 R3.1
N$10
  Top 0.254: JP5.7 7.88,25.53 7.88,24.77 8.01,24.64 8.01,24.52 8.39,24.13 R2.1
N$11
  Top 0.254: R1.1 8.63,27.32 JP5.8
N$12
  Top 0.178: U2.8 U2.7 27.18,9.91 26.29,10.8 25.8,10.8 R12.1
N$13
  Top 0.254: JP5.4 R5.1
N$14
  Top 0.178: R6.1 8.63,19.04 7.75,18.17 7.75,17.53 JP5.3
N$15
  Top 0.178: R7.1 8.63,15.86 JP5.2
N$16
  Top 0.178: R8.1 9.02,15.64 9.02,15.63 8.01,14.61 8.01,12.7 JP5.1
N$17
  Bottom 0.178: 19.05,27.94 20.32,27.94
N$18
  Top 0.178: R51.2 49.27,30.38 LED7.A
N$19
  Top 0.178: JP16.2 59.31,30.99 59.19,30.99 58.06,29.86 R39.1
N$20
  Top 0.178: R40.1 58.06,27.32 59.06,28.33 59.19,28.33 JP16.3
N$21
  Bottom 0.178: 51.19,38.23 52.2,38.23
N$22
  Top 0.178: R42.1 58.81,22.86 JP16.5
N$23
  Top 0.178: R43.1 JP16.6
N$24
  Top 0.178: R44.1 58.81,20.32 JP16.7
N$25  (via drill 0.38)
  Top 0.178: U$13.16 34.68,3.68 v34.93,3.43 | v34.17,10.16 SJ6.1
  Route15 0.178: v34.93,3.43 35.82,3.43 37.09,4.7 37.09,6.99 36.33,7.75 35.44,7.75 34.17,9.02 v34.17,10.16
N$26
  Top 0.178: U$13.8 32.66,7.12 C8.1
N$27
  Top 0.178: C8.2 30.85,6.34 30.23,5.72 29.47,5.72 29.09,5.34 29.09,3.31 29.47,2.93 31.5,2.93 32.01,3.43 U$13.12
N$28
  Top 0.254: R13.1 LED1.A
N$29
  Top 0.178: LED5.A R35.2
N$30
  Top 0.178: LED4.A R32.2
N$31
  Top 0.254: R18.1 LED2.A
N$32  (via drill 0.38)
  Top 0.178: R30.2 29.72,13.97 28.33,12.58 27.56,12.58 v27.18,12.2 | U$7.10 34.41,23.1 v34.8,22.74
  Bottom 0.178: v27.18,12.2 27.06,12.2 24.64,14.61 24.64,19.94 27.44,22.74 v34.8,22.74
N$33  (via drill 0.38)
  Top 0.178: R27.2 29.09,12.7 v28.2,11.82 | U$7.6 32.41,23.39 32.37,23.39 32.26,23.5 v32.01,23.5
  Bottom 0.178: v28.2,11.82 27.82,11.43 26.93,11.43 24.26,14.1 24.26,20.07 27.31,23.12 31.63,23.12 v32.01,23.5
N$34
  Top 0.254: R20.1 LED3.A
N$36  (via drill 0.38)
  Top 0.178: R17.2 34.55,31.75 v35.95,33.15
  Bottom 0.178: v35.95,33.15 35.56,33.15 34.8,32.39 SJ103.1
N$38  (via drill 0.38)
  Top 0.254: R24.2 39.61,31.13 v40.39,30.36
  Bottom 0.254: v40.39,30.36 40.9,30.36 41.41,30.87 SJ101.1
N$39  (via drill 0.38)
  Top 0.178: R21.2 35.95,31.63 36.71,32.39 37.85,32.39 v38.49,33.02
  Bottom 0.254: v38.49,33.02 38.23,32.77 38.1,32.64 SJ102.1
N$40
  Bottom 0.254: 34.04,31.75 34.68,31.75
N$41
  Bottom 0.254: 37.34,31.75 37.98,31.75
N$42
  Bottom 0.254: 40.77,31.75 41.15,31.75
N$56
  Top 0.178: IC1.34 19.98,12.67 20.64,12.01 U1.3 20.58,11.49
N$89
  Top 0.178: IC1.33 19.48,12.62 19.44,12.58 18.42,12.58 18.29,12.45 18.29,11.49 U1.1
PA1
  Top 0.178: IC1.77 27.48,30.9 28.33,31.75 R47.1
PA2
  Top 0.178: R46.1 28.87,30.48 IC1.76
PA3  (via drill 0.38)
  Top 0.178: IC1.75 29.98,28.2 v29.6,28.2 | LED3.C v5.97,8.89
  Bottom 0.178: v29.6,28.2 29.21,28.2 27.56,26.55 24.77,26.55 24.64,26.42 23.25,26.42 22.74,25.91 22.74,24.9 19.56,21.72 17.28,21.72 16.26,20.71 16.26,17.91 16.13,17.78 14.86,17.78 13.47,16.39 13.47,12.45 10.8,9.78 8.26,9.78 7.37,8.89 v5.97,8.89
PA4  (via drill 0.38)
  Top 0.178: IC1.74 29.05,27.09 28.83,27.31 28.33,27.31 27.18,26.17 25.02,26.17 24.52,25.66 v23.5,25.66 | LED2.C v5.97,7.62
  Bottom 0.178: v23.5,25.66 23.5,25.15 19.69,21.34 17.4,21.34 16.64,20.58 16.64,17.66 16.39,17.4 14.99,17.4 13.85,16.26 13.85,12.32 10.93,9.4 8.39,9.4 6.61,7.62 v5.97,7.62
PA5  (via drill 0.38)
  Top 0.178: IC1.73 28.63,26.59 v28.58,26.55 | LED1.C v5.85,6.35
  Bottom 0.178: v28.58,26.55 28.2,26.17 25.02,26.17 19.82,20.96 17.53,20.96 17.02,20.45 17.02,17.4 16.64,17.02 15.12,17.02 14.23,16.13 14.23,12.2 11.05,9.02 8.51,9.02 v5.85,6.35
PA6  (via drill 0.38)
  Top 0.178: IC1.72 30.94,26.09 31.12,25.91 31.12,23.27 32.8,21.59 36.58,21.59 36.83,21.34 36.83,19.69 v37.09,19.44 | U$15.3 40.64,10.16 40.26,10.55 40.26,12.45 v40.64,12.83
  Bottom 0.178: v37.09,19.44 37.09,18.67 34.42,16.01 33.53,16.01 33.15,15.63 33.15,14.86 33.53,14.48 35.95,14.48 36.33,14.1 39.25,14.1 39.5,13.85 39.5,13.21 39.88,12.83 v40.64,12.83
PB0  (via drill 0.38)
  Top 0.178: IC1.19 16.18,18.59 v17.78,20.2 | U$14.8 40.16,26.57 40.64,27.06 v41.79,27.06
  Route15 0.178: v41.79,27.06 40.14,28.71 v37.09,28.71
  Bottom 0.178: v37.09,28.71 36.56,28.17 31.22,28.17 28.83,25.79 25.15,25.79 19.82,20.45 18.04,20.45 v17.78,20.2
PB1  (via drill 0.38)
  Top 0.178: IC1.20 16.19,18.09 17.53,19.44 18.51,19.44 v18.8,19.73 | U$14.10 39.36,26.78 40.77,28.2 42.3,28.2 43.57,29.47 43.57,35.56 U7.3
  Bottom 0.178: U7.3 41.03,35.56 41.03,33.66 41.79,32.9 42.42,32.9 42.8,32.52 42.8,28.71 42.3,28.2 40.77,28.2 39.76,27.18 38.61,27.18 37.98,27.82 31.37,27.82 28.96,25.4 25.28,25.4 19.6,19.73 v18.8,19.73
PB2  (via drill 0.38)
  Top 0.178: IC1.21 16.71,17.59 v17.78,18.67 | U$14.9 39.76,26.67 40.9,27.82 42.42,27.82 43.95,29.34 43.95,32.14 44.58,32.77 45.22,32.77 46.11,33.66 46.11,35.56 U7.4
  Bottom 0.178: U7.4 46.11,35.56 46.11,33.66 43.95,31.5 43.95,26.93 43.06,26.04 38.23,26.04 37.6,26.67 31.75,26.67 29.34,24.26 25.66,24.26 20.32,18.93 20.32,18.29 19.05,17.02 17.91,17.02 17.66,17.28 17.66,18.55 v17.78,18.67
PB3  (via drill 0.38)
  Top 0.178: v18.42,17.78 17.4,17.78 16.71,17.09 IC1.22 | U$14.7 41.98,26.1 42.55,26.67 42.55,27.44 44.33,29.21 44.33,32.01 44.71,32.39 45.34,32.39 46.49,33.53 46.49,36.58 v46.74,36.83
  Bottom 0.178: v18.42,17.78 19.31,17.78 19.94,18.42 19.94,19.05 25.53,24.64 29.21,24.64 31.63,27.06 37.72,27.06 38.36,26.42 42.93,26.42 43.57,27.06 43.57,37.47 44.2,38.1 45.47,38.1 v46.74,36.83 47.5,36.83 47.76,37.09 49.53,37.09 50.04,37.6 50.42,37.6 SJ3.1
PB3_PIN  (via drill 0.38)
  Top 0.178: U7.1 43.57,38.1 45.47,38.1 v46.74,39.37
  Bottom 0.178: SJ3.2 52.46,39.76 52.07,40.14 47.5,40.14 v46.74,39.37
PB5
  Top 0.178: IC1.24 12.87,16.09 12.45,16.51 12.45,16.9 11.56,17.78 R7.2
PB6
  Top 0.178: IC1.25 12.74,15.59 11.82,16.51 R8.2
PB7  (via drill 0.38)
  Top 0.178: 32.52,31.75 R17.1 32.77,31.74 32.77,30.36 32.26,29.85 v32.26,29.21 | IC1.26 15.98,15.15 v15.88,15.24
  Route15 0.178: v21.59,16.39 21.59,17.4 22.1,17.91 22.1,21.72 25.79,25.4 28.83,25.4 32.01,28.58 32.01,28.96 v32.26,29.21
  Bottom 0.178: v21.59,16.39 20.83,16.39 20.71,16.26 19.94,16.26 19.56,16.64 17.28,16.64 v15.88,15.24
PC4  (via drill 0.38)
  Top 0.178: IC1.57 28.37,18.59 v28.2,18.42 | R48.1 42.66,16.91 v42.68,16.9
  Bottom 0.178: v28.2,18.42 28.33,18.42 30.48,20.58 39.5,20.58 42.04,18.04 42.04,17.53 v42.68,16.9
PC6  (via drill 0.38)
  Top 0.178: U$13.15 33.66,3.06 34.04,2.67 35.44,2.67 36.33,3.56 36.33,4.96 36.83,5.47 36.83,8.01 34.8,10.04 34.8,11.31 34.29,11.82 32.26,11.82 v32.01,11.56 | IC1.59 27.98,19.59 26.8,18.42 25.46,18.42 v25.4,18.47
  Bottom 0.178: v32.01,11.56 30.61,12.96 26.8,12.96 25.02,14.74 25.02,18.09 v25.4,18.47
PC7_LED  (via drill 0.38)
  Top 0.178: LED7.C v50.93,30.48 | U10.22 55.24,26.15 55.76,26.67 55.76,27.56 56.27,28.07 56.27,30.1 v56.14,30.23
  Bottom 0.178: v50.93,30.48 51.44,30.99 55.38,30.99 v56.14,30.23
PD0
  Top 0.178: U2.6 27.44,10.42 26.42,11.43 25.66,11.43 24.48,12.62 IC1.43
PD1
  Top 0.178: U2.5 27.4,10.96 26.55,11.82 25.79,11.82 24.98,12.63 IC1.44
PD2  (via drill 0.38)
  Top 0.178: IC1.45 25.48,15.19 v25.91,15.63 | GPS.3 55.77,6.24 56.27,6.74 U$18.3
  Bottom 0.178: v25.91,15.63 26.67,16.39 26.67,16.97 27.44,17.73 27.44,18.8 29.6,20.96 38.74,20.96 40.77,22.99 40.77,24.9 41.15,25.28 43.31,25.28 44.71,26.67 44.71,30.87 45.22,31.37 56.39,31.37 57.28,30.48 57.28,27.94 56.27,26.93 56.27,24.01 56.77,23.5 56.77,19.94 56.01,19.18 56.01,15.63 55.63,15.24 55.63,10.67 56.27,10.04 U$18.3
PD3  (via drill 0.38)
  Top 0.178: IC1.46 25.98,14.67 26.17,14.86 26.29,14.86 26.67,15.24 26.67,16.46 26.42,16.72 v25.91,16.72 | GPS.4 56.77,6.09 57.54,6.86 57.54,7.99 U$18.2
  Bottom 0.178: v25.91,16.72 27.06,17.86 27.06,18.93 29.47,21.34 38.61,21.34 40.39,23.12 40.39,25.02 41.03,25.66 43.18,25.66 44.33,26.8 44.33,30.99 45.09,31.75 56.52,31.75 57.66,30.61 57.66,27.82 56.65,26.8 56.65,24.13 57.15,23.63 57.15,19.82 56.39,19.05 56.39,15.5 56.01,15.12 56.01,11.43 57.52,9.93 U$18.2
PE0  (via drill 0.38)
  Top 0.178: IC1.2 12.49,27.09 v12.32,26.93 | R30.1 31.52,13.96 v32.52,12.96
  Route2 0.178: v41.03,2.42 41.28,2.67 43.44,2.67 JP14.1
  Route15 0.178: v12.32,26.93 14.36,24.9 14.36,14.61 15.24,13.72 27.69,13.72 28.07,13.34 32.14,13.34 v32.52,12.96 36.2,9.28 41.41,9.28 42.04,8.64 42.04,3.43 v41.03,2.42
PE1  (via drill 0.38)
  Top 0.178: IC1.3 14.82,26.59 v15.75,25.66 | v33.66,13.21 33.66,12.7 33.15,12.2 32.02,12.2 R27.1
  Route15 0.178: v15.75,25.66 14.74,24.64 14.74,14.74 15.37,14.1 27.82,14.1 28.2,13.72 33.15,13.72 v33.66,13.21 33.66,12.32 36.33,9.66 41.53,9.66 42.42,8.77 42.42,1.4 JP14.2
PE3
  Top 0.178: IC1.5 10.12,25.59 R1.2
PE4
  Top 0.178: IC1.6 10.89,25.09 R2.2
PE5
  Top 0.178: IC1.7 11.39,24.59 10.67,23.88 10.67,23.61 R3.2
PE6  (via drill 0.38)
  Top 0.178: IC1.8 15.71,24.09 v16.9,25.28 | R19.2 11.2,26.79 v11.18,26.8
  Route15 0.178: v16.9,25.28 16.9,25.79 16.26,26.42 13.47,26.42 13.21,26.67 13.21,27.44 12.96,27.69 11.94,27.69 11.56,27.31 11.56,27.18 v11.18,26.8
PF0
  Top 0.178: IC1.97 17.48,32.44 17.28,32.64 15.5,32.64 15.12,33.02 13.09,33.02 JP8.1
PF1
  Top 0.178: IC1.96 17.98,32.58 17.53,33.02 15.63,33.02 JP8.2
PF2
  Top 0.178: IC1.95 18.48,32.71 JP8.3
PF3
  Top 0.178: IC1.94 18.98,32.06 19.44,32.52 JP8.4
PF4
  Top 0.178: IC1.93 19.48,31.79 JP8.5
PF5
  Top 0.178: IC1.92 19.98,31.28 21.72,33.02 23.25,33.02 JP8.6
PF6
  Top 0.178: IC1.91 20.48,31.27 21.85,32.64 25.4,32.64 JP8.7
PF7
  Top 0.178: IC1.90 20.98,31.26 21.98,32.26 25.53,32.26 26.29,33.02 27.82,33.02 28.33,33.53 28.33,33.91 28.71,34.29 JP8.8
PG0  (via drill 0.38)
  Top 0.178: IC1.51 30.77,15.59 v31.12,15.24 | U$15.2 41.13,10.56 40.9,10.8 40.9,12.07 41.41,12.58 41.41,12.83 v41.66,13.09
  Bottom 0.178: v31.12,15.24 32.26,15.24 33.41,16.39 34.29,16.39 36.33,18.42 36.33,19.82 36.71,20.2 39.37,20.2 41.66,17.91 v41.66,13.09
PG1  (via drill 0.38)
  Top 0.178: IC1.52 29.18,16.09 28.94,15.85 28.94,15.02 v28.76,14.84 | v38.49,13.21 R10.2
  Route2 0.178: v28.76,14.84 28.76,14.86
  Bottom 0.178: v38.49,13.21 37.98,13.72 36.2,13.72 35.82,14.1 33.41,14.1 33.02,14.48 29.11,14.48 v28.76,14.84
PH0  (via drill 0.38)
  Top 0.178: IC1.12 12.7,22.09 v12.45,22.36
  Route15 0.178: v12.45,22.36 13.59,21.21 13.59,14.36 14.99,12.96 25.15,12.96 25.4,12.7 25.4,5.34 26.29,4.45 28.96,4.45 JP13.2
  Bottom 0.178: v12.45,22.36 14.23,24.13 14.23,26.17 14.86,26.8 16.26,26.8 SJ1.1
PH1  (via drill 0.38)
  Top 0.178: IC1.13 12.83,21.59 v12.45,21.21
  Route15 0.178: v12.45,21.21 11.69,21.98 11.69,22.74 12.07,23.12 12.96,23.12 13.97,22.1 13.97,14.48 15.12,13.34 25.4,13.34 25.79,12.96 25.79,5.59 26.55,4.83 29.21,4.83 31.63,2.42 33.53,2.42 JP13.1
  Bottom 0.178: v12.45,21.21 11.69,21.98 11.69,22.74 13.85,24.9 13.85,26.29 14.74,27.18 16.01,27.18 16.26,27.44 16.26,28.96 SJ4.1
PH3
  Top 0.178: IC1.15 13.1,20.59 12.96,20.45 11.07,20.45 R4.2
PH4
  Top 0.178: IC1.16 10.2,20.09 R5.2
PH5
  Top 0.178: IC1.17 11.21,19.59 10.67,19.05 R6.2
PJ0
  Top 0.178: IC1.63 30.76,21.59 32.54,19.82 34.04,19.82 34.42,19.44 34.42,16.26 35.21,15.47 35.21,10.14 36.71,8.64 42.04,8.64 42.42,8.26 43.82,8.26 45.22,9.66 48.9,9.66 49.28,9.28 IC2.8
PJ1  (via drill 0.38)
  Top 0.178: IC1.64 30.77,22.09 32.67,20.2 34.17,20.2 34.8,19.56 34.8,16.39 35.56,15.63 35.56,10.29 36.83,9.02 40.52,9.02 40.86,9.36 U$15.5
  Top 0.254: IC1.64 28.59,22.09 v28.45,21.98
PJ2
  Top 0.178: IC1.65 30.78,22.59 32.8,20.58 34.29,20.58 35.18,19.69 35.18,16.51 35.95,15.75 35.95,10.42 36.96,9.4 40.26,9.4 40.63,9.76 U$15.4
PJ3
  Top 0.178: IC1.66 30.79,23.09 32.92,20.96 35.96,20.96 R22.2
PK0
  Top 0.178: IC1.89 21.48,31.25 22.1,31.88 25.66,31.88 26.42,32.64 27.94,32.64 28.33,33.02 30.87,33.02 JP8.9
PK1  (via drill 0.38)
  Top 0.178: IC1.88 21.98,31.25 22.23,31.5 25.79,31.5 26.55,32.26 28.07,32.26 28.45,32.64 32.9,32.64 v33.41,33.15
  Bottom 0.178: v33.41,33.15 33.02,32.77 SJ103.3
  Bottom 0.254: SJ103.3 33.02,32.01
PK2  (via drill 0.38)
  Top 0.178: IC1.87 22.48,28.7 v21.98,28.2
  Bottom 0.178: SJ102.3 36.33,30.99 36.07,30.74 32.64,30.74 32.39,30.99 30.87,30.99 30.23,30.36 23.88,30.36 21.98,28.45 v21.98,28.2
PK3  (via drill 0.38)
  Top 0.178: IC1.86 22.98,28.47 v22.99,28.2
  Bottom 0.178: SJ101.3 39.63,30.99 39.37,30.74 36.58,30.74 36.2,30.36 32.52,30.36 32.26,30.61 30.99,30.61 30.36,29.98 24.01,29.98 22.99,28.96 v22.99,28.2
PK4  (via drill 0.38)
  Top 0.178: IC1.85 23.48,28.73 23.75,28.45 23.75,27.56 v23.63,27.44 | v10.29,10.93 10.55,10.67 10.55,5.97 | 10.55,5.97 10.29,5.72 | 10.29,5.72 U$17.3 | 10.55,5.97 10.29,5.72
  Bottom 0.178: v23.63,27.44 23.25,27.44 21.98,26.17 21.98,25.15 19.31,22.48 17.02,22.48 15.5,20.96 15.5,18.67 15.37,18.55 14.61,18.55 12.7,16.64 12.7,12.7 11.31,11.31 10.67,11.31 v10.29,10.93
PK5  (via drill 0.38)
  Top 0.178: IC1.84 23.98,28.74 24.52,28.2 v24.52,27.82
  Bottom 0.178: v24.52,27.82 24.52,27.18 24.13,26.8 23.12,26.8 22.36,26.04 22.36,25.02 19.44,22.1 17.15,22.1 15.88,20.83 15.88,18.55 15.5,18.17 14.74,18.17 13.09,16.51 13.09,12.58 10.67,10.16 8.13,10.16 7.62,9.66 5.47,9.66 5.08,9.28 5.08,5.97 5.72,5.34 7.37,5.34 8.26,4.45 9.27,4.45 U$17.4
PL1
  Top 0.178: IC1.36 20.98,12.69 21.09,12.58 23.37,12.58 24.52,11.43 R11.1
PL4  (via drill 0.38)
  Top 0.178: IC1.39 22.48,16.89 v22.48,17.02 | R21.1 35.45,29.83 35.18,30.1 34.29,30.1 v33.91,29.72
  Top 0.254: IC1.39
  Route15 0.178: v22.48,17.02 22.48,21.59 25.91,25.02 28.96,25.02 32.39,28.45 33.28,28.45 33.91,29.09 v33.91,29.72
PL5  (via drill 0.38)
  Top 0.178: IC1.40 22.98,15.99 v23.37,16.39 | v38.23,29.47 37.72,29.85 R24.1
  Route15 0.178: v23.37,16.39 23.37,17.4 22.86,17.91 22.86,21.47 26.04,24.64 29.09,24.64 32.52,28.07 36.07,28.07 36.33,28.33 36.33,29.21 36.58,29.47 v38.23,29.47
PPM_IN  (via drill 0.38)
  Top 0.178: v28.83,6.74 28.45,7.12 24.9,7.12 24.52,7.5 R11.2 24.5,9.53 23.25,9.53 22.86,9.91 TP2.TP
  Bottom 0.178: v28.83,6.74 29.47,7.37 31.88,7.37 33.02,8.51 43.95,8.51 44.33,8.89 50.68,8.89 53.73,11.94 53.73,16.77 53.22,17.28 SJ2.2
PPM_MISO  (via drill 0.38)
  Top 0.178: U10.17 55.48,23.65 v55.76,23.37 56.27,22.86 R42.2
  Bottom 0.178: U8.1 47.38,7.62 47.88,8.13 50.93,8.13 54.49,11.69 54.49,15.63 54.87,16.01 54.87,22.48 v55.76,23.37
PPM_MOSI  (via drill 0.38)
  Top 0.178: U10.16 54.21,22.64 54.74,22.1 55.5,22.1 v55.63,21.98 56.01,21.59 R43.2
  Bottom 0.178: U8.4 48.65,5.08 48.65,7.37 49.03,7.75 51.06,7.75 54.87,11.56 54.87,15.5 55.25,15.88 55.25,21.59 v55.63,21.98
PPM_OUT  (via drill 0.38)
  Top 0.178: U10.23 55.23,26.65 55.38,26.8 55.38,27.82 55.5,27.94 55.5,28.58 55.76,28.83 55.76,29.6 v55.12,30.23
  Bottom 0.178: v55.12,30.23 54.74,30.61 53.6,30.61 53.09,30.1 53.09,27.69 53.47,27.31 54.23,27.31 54.49,27.06 54.49,23.88 54.11,23.5 54.11,19.05 53.85,18.8 SJ2.1 51.69,17.4
PPM_PC2  (via drill 0.38)
  Top 0.178: U$7.1 34.41,26.69 v35.18,25.91 | U$7.5 32.41,26.82 32.39,26.8 v32.39,25.91 | U10.5 49.66,25.15 49.53,25.28 48.65,25.28 48.26,24.9 48.26,22.99 v48.42,22.89
  Route15 0.178: v48.42,22.89 47.88,22.36 47.25,22.36 46.11,23.5 45.09,23.5 43.06,25.53 37.72,25.53 37.6,25.4 35.69,25.4 v35.18,25.91
  Bottom 0.178: v35.18,25.91 35.06,25.79 35.06,25.4 34.8,25.15 33.66,25.15 33.15,25.66 32.64,25.66 v32.39,25.91
PPM_PC4  (via drill 0.38)
  Top 0.178: U10.26 53.71,28.43 v53.85,28.58 | v53.34,20.2 53.22,20.07 53.22,17.91 54.36,16.77 54.36,16.13 54.87,15.63 54.87,13.59 55.12,13.34 57.03,13.34 57.41,12.96 57.41,12.32 57.54,12.2 61.47,12.2 61.98,12.7 X4.1
  Route15 0.178: v53.85,28.58 53.85,21.85 54.11,21.59 54.11,20.96 v53.34,20.2
PPM_PD0  (via drill 0.38)
  Top 0.178: U10.6 49.17,24.65 v49.03,24.52 | 31.5,31.75 R47.2 31.12,31.75 30.87,31.5 30.87,29.47 v30.74,29.34
  Route15 0.178: v49.03,24.52 48.39,24.52 48.26,24.64 45.47,24.64 43.69,26.42 43.69,30.61 42.68,31.63 32.64,31.63 31.63,30.61 31.12,30.61 30.74,30.23 v30.74,29.34
PPM_PD1  (via drill 0.38)
  Top 0.178: U10.7 49.81,24.15 49.23,23.58 v49.23,23.37 | R46.2 31.52,29.99 v31.5,29.98
  Route15 0.178: v49.23,23.37 49.03,23.37 48.14,24.26 45.34,24.26 43.31,26.29 43.31,30.48 42.55,31.25 32.77,31.25 v31.5,29.98
PPM_PD6
  Top 0.178: U10.12 52.21,21.97 52.58,21.59 52.58,19.82 52.84,19.56 52.84,17.78 53.98,16.64 53.98,16.01 54.49,15.5 54.49,13.34 54.87,12.96 56.77,12.96 57.03,12.7 57.03,12.07 57.28,11.82 61.73,11.82 62.87,10.67 X2.1
PPM_RST  (via drill 0.38)
  Top 0.178: U10.24 54.76,27.83 55.12,28.2 v55.12,29.24 | R37.1 56.27,17.53 55.63,18.17 v54.11,18.17
  Bottom 0.178: U8.5 46.11,2.54 46.11,7.5 47.12,8.51 50.8,8.51 54.11,11.82 54.11,15.75 54.49,16.13 54.49,17.78 v54.11,18.17 54.49,18.55 54.49,23.37 54.87,23.75 54.87,27.06 55.12,27.31 v55.12,29.24
PPM_RX  (via drill 0.38)
  Top 0.178: U$7.4 32.91,29.86 33.53,30.48 38.74,30.48 39.63,29.6 40.64,29.6 v41.28,28.96 | U10.8 50.16,22.98 49.28,22.1 48.14,22.1 47.5,22.74 v47.5,23.12
  Route15 0.178: v47.5,23.12 46.74,23.88 45.22,23.88 42.93,26.17 42.93,28.83 42.8,28.96 v41.28,28.96
PPM_SCK  (via drill 0.38)
  Top 0.178: R44.2 56.76,20.45 v56.01,20.45 55.88,20.45 53.71,22.63 U10.15
  Bottom 0.178: U8.3 48.65,2.54 50.42,2.54 51.19,3.31 51.19,7.37 55.25,11.43 55.25,15.37 55.63,15.75 55.63,20.07 v56.01,20.45
PPM_TX  (via drill 0.38)
  Top 0.178: U$7.2 v33.91,25.9 v33.91,25.91 | U10.9 50.71,22.38 v50.42,22.1
  Route15 0.178: v50.42,22.1 50.3,22.23 48.26,22.23 48.01,21.98 47.12,21.98 45.98,23.12 44.96,23.12 42.93,25.15 37.85,25.15 37.72,25.02 34.8,25.02 v33.91,25.91
R_JP_RX
  Top 0.178: R49.1 11.82,32.52 11.31,33.02 10.55,33.02 10.16,33.41 10.16,35.31 9.02,36.45 U$20.3
R_JP_TX
  Top 0.178: R50.1 10.53,32.4 9.78,33.15 9.78,34.55 9.15,35.18 8.03,35.18 U$20.2
RD+
  Top 0.178: U10.29 52.21,31.25 52.71,31.75 52.71,32.26 52.47,32.37 R34.1
RD-
  Top 0.178: U10.30 51.71,31.26 51.19,31.75 R31.1
RST  (via drill 0.38)
  Top 0.178: v19.05,18.67 19.31,18.42 19.31,17.4 17.66,15.75 17.66,14.99 17.98,14.67 IC1.30 17.98,12.77 17.28,12.2 | C15.2 22.61,6.35 S1.3 | JP11.1 24.52,2.04 23.37,3.18 21.98,3.18 S1.3 | D3.A 17.28,6.35 19.18,4.45 S1.3
  Top 0.254: D2.C 42.23,32.33 R26.1 U7.5 | 17.28,12.2 17.28,10.42 17.66,10.04 18.8,10.04 19.31,9.53 19.31,8.01 18.8,7.5 17.46,7.5 D3.A
  Bottom 0.178: U7.5 43.18,33.41 43.18,28.58 42.42,27.82 40.9,27.82 39.88,26.8 38.49,26.8 37.85,27.44 31.5,27.44 29.09,25.02 25.4,25.02 v19.05,18.67
RST_DF
  Top 0.178: U$15.10 43.58,10.56 46.74,13.72 IC2.3
RXLED
  Top 0.178: U10.10 51.21,22.59 51.31,22.48 51.31,21.85 51.82,21.34 51.82,19.56 52.07,19.31 52.07,17.53 53.22,16.39 53.22,15.49 LED4.C
SCK_3V3
  Top 0.178: U5.23 43.58,21.07 44.33,20.32 45.17,20.32 | 45.17,20.32 46.6,20.32 U$12.8 | 45.17,20.32 45.17,21.77 44.96,21.98 44.96,22.86 44.58,23.25 40.01,23.25 39.36,23.9 U$14.2
SCK_DF
  Top 0.178: U$15.8 43.8,9.76 46.61,12.58 47.38,12.58 48.01,13.21 IC2.2
SCL1  (via drill 0.38)
  Top 0.178: v32.14,10.16 31.88,9.91 31.75,9.91 U2.2 | U$13.1 35.68,4.33 v35.69,4.32 | R9.1 13.22,4.58 U$19.2
  Route15 0.178: v35.69,4.32 36.71,5.34 36.71,6.86 36.2,7.37 35.31,7.37 32.77,9.91 32.39,9.91 v32.14,10.16
  Bottom 0.178: v32.14,10.16 30.1,8.13 28.33,8.13 27.31,7.12 15.5,7.12 14.99,6.61 14.99,4.96 14.48,4.45 U$19.2
SDA1  (via drill 0.38)
  Top 0.178: v29.72,6.48 29.72,7.88 30.48,8.64 | v31.63,8.64 30.48,8.64 | 30.48,8.64 30.23,8.89 30.23,10.16 30.48,10.41 U2.3 31.5,10.41 31.63,10.55 31.63,10.67 31.75,10.8 32.9,10.8 SJ6.2 | 13.08,3.18 U$19.3 13.2,3.31 R16.1
  Top 0.254: U2.3
  Bottom 0.178: v29.72,6.48 28.58,5.34 27.18,5.34 25.79,6.74 15.63,6.74 15.37,6.48 15.37,3.69 14.86,3.18 13.1,3.18 U$19.3
SJ0
  Bottom 0.178: SJ103.2 33.91,32.39 34.68,33.15 JP8.10
SJ1
  Bottom 0.178: SJ102.2 JP8.11
SJ2
  Bottom 0.178: SJ101.2 40.52,33.53 JP8.12
SPI_OE  (via drill 0.38)
  Top 0.178: R25.2 37.22,13.97 36.71,14.48 v36.71,14.99 | U$14.12 37.98,25.4 v37.22,26.04 | U$15.12 42.3,11.43 43.06,12.2 v43.06,12.83
  Top 0.203: D2.A 39.81,28.63 v39.12,27.94
  Route15 0.178: 36.71,27.69 32.64,27.69 30.1,25.15 30.1,22.23 31.37,20.96 33.79,20.96 35.18,19.56 35.18,16.51 v36.71,14.99 37.6,14.1 41.79,14.1 v43.06,12.83 | 36.71,27.69 38.87,27.69 v39.12,27.94 | v37.22,26.04 37.22,27.18 36.71,27.69
SS_3V3  (via drill 0.38)
  Top 0.178: U5.8 39.87,21.07 v40.03,21.21 | U$14.4 40.16,24.24 40.39,24.01 41.03,24.01 v41.41,24.39
  Bottom 0.178: v40.03,21.21 40.01,21.21 41.15,22.36 41.15,24.13 v41.41,24.39
TXLED
  Top 0.178: U10.11 51.71,21.96 52.2,21.47 52.2,19.69 52.46,19.44 52.46,17.66 53.6,16.51 53.6,15.37 53.73,15.24 LED5.C
USHIELD
  Top 0.178: L1.2 48.65,33.66
  Top 0.254: 48.65,33.66 49.53,32.77 49.79,32.77 49.92,32.64 Z1.2 | 56.65,39.03 U9.GND1 54.74,38.56 | 54.74,38.56 U9.GND2 U9.GND3 50.17,38.56 | 50.17,38.56 U9.GND4 | 50.17,38.56 50.17,37.34 49.92,37.09 48.9,37.09 48.52,36.83 48.52,35.18 48.65,35.06 L1.2 | 54.74,38.56 54.74,37.6 57.28,35.06 57.28,34.31 Z2.2
VCC  (via drill 0.38, 0.6)
  Top 0.178: U10.32 50.03,27.7 v49.53,28.2 49.55,28.2 R51.1 50.57,28.95 51.21,28.31 U10.31 | R14.1 31.52,19.05 C3.1 31.5,19.07 31.5,20.07 30.98,20.59 IC1.61 26.56,20.59 v26.29,20.32 | IC1.80 25.98,28.64 v26.42,28.2 | IC1.31 18.48,15.32 v18.42,15.37 | IC1.10 15.73,23.09 v16.39,23.75 | C5.2 35.82,23.37 | U$7.8 33.41,22.36 33.79,21.98 36.58,21.98 v36.96,22.36 | U10.25 54.21,27.92 54.49,28.2 54.49,28.96 v53.85,29.6 | C14.1 46.34,23.75 47.25,23.75 47.88,24.39 47.88,25.02 48.51,25.65 48.87,25.65 v49.23,26.01 49.59,25.65 U10.4 | U$14.11 38.96,26.46 38.61,26.8 36.96,26.8 36.58,26.42 36.58,25.53 37.47,24.64 37.47,23.75 36.96,23.25 | R26.2 42.3,30.61 v41.66,29.98 | v58.42,14.23 57.54,15.12 C16.1 R37.2 | U$18.1 58.81,8.05 58.81,9.28 58.3,9.78 55.5,9.78 55,10.29 R36.2 R35.1 R32.1 51.84,10.16 50.42,10.16 50.17,10.42 50.17,14.86 49.66,15.37 45.34,15.37 44.45,14.48 44.45,11.94 43.48,10.96 U$15.11 | D3.C 19.82,6.35 | C2.1 13.99,28.96 v15.12,28.96 15.75,29.59 IC1.100
  Top 0.254: IC1.100 | R12.2 26.56,9.51 v27.18,8.89 | v36.96,22.36 36.96,23.25 36.72,23.48 35.83,23.48 | F1.2 58.81,39.25 60.46,37.6 60.46,36.45 JP18.1 | R20.2 R18.2 R13.2 1.01,5.32 v0.89,5.21 | GPS.5 57.77,6.08 58.68,6.99 58.68,7.92 U$18.1 | v20.45,5.59 20.45,5.92 D3.C
  Top 0.305: 35.83,23.48 C5.2
  Top 0.406: JP14.3 39.76,3.8 C21.2 41.32,3.81 U3.1 41.35,4.13
  Top 0.61: F2.2 16.26,8.95 D4.C v17.28,8.89
  Route2 0.254: v36.96,22.36 35.82,23.5 35.82,25.02 36.2,25.4 36.2,26.42
  Route2 0.813: JP14.3 37.22,3.81 37.22,4.58 36.45,5.34 30.36,5.34 29.6,4.58 JP12.2
  Route15 0.305: v17.28,8.89 19.31,8.89 20.45,7.75 v20.45,5.59
  other vias: 16.26,9.91
  pour Route2 (isolate 0.254): 0,0 0,40.64 71.76,40.64 71.76,0 46.23,0 46.23,8.01 46.87,8.64 51.44,8.64 53.98,11.18 53.98,24.26 52.2,26.04 32.39,26.04 30.61,24.26 30.61,0
VUCAP
  Top 0.178: U10.27 53.21,28.08 52.58,28.71 52.58,30.87 52.84,31.12 53.71,31.12 C17.1
XT1
  Top 0.178: R28.1 R29.2 46.73,27.02 Y1.3
XT1R
  Top 0.178: U10.1 49.56,27.15 48.77,27.94 48.77,28.47 R28.2
XT2
  Top 0.178: Y1.1 47.39,24.66 47.5,24.77 47.5,25.28 48.65,26.42 48.65,27.08 48.89,27.32 | U10.2 49.66,26.65 49.53,26.78 49.43,26.78 48.89,27.32 | 48.89,27.32 48.52,27.69 48.28,27.69 R29.1
XUSB
  Top 0.254: U9.1 53.76,33.88 54.23,33.41 58.17,33.41 58.42,33.66 58.42,35.31 58.81,35.69 F1.1

## Text on the board
tPlace: 3DR-RADIO | + | - | AREF | AT2560 SPI | OUT | - | + | s | Inputs | Outputs | JP | 1 | Front | s | JP4 | + | - | RX | TX | Alive | JP3 | PPM | GPS/UART1 | JP2 | C | B | I2C | ATx-U2 | A | SPI | Reset | PM
bPlace: MISO LVL | GND | UART0/2 | RX | TX | 5V | 3V3 | IN8 | +5V | A0 | A1 | A2 | A3 | A4 | A5 | A6 | A7 | A8 | IN7 | UART2 | UART0 | A9 | OUT9 | A10 | OUT10 | A11 | OUT11 | IN6 | OUT8 | Inputs | IN5 | OUT7 | Y | AutoMUX | Z | IN4 | OUT6 | FRONT | IN3 | OUT5 | OUT4 | <-PPM | IN2 | X | ->PPM | Outputs | IN1 | OUT3 | <-CH5 | OUT2 | S | JP4 | + | - | JP1 | JP3 | OUT1 | GPS/UART1 | - | 5V | S | JP2 | V2.5.2 | RESET | UART2 | UART0 | PWR-M&R | I2C | GND | NC | GND | RST | GND | +5V | RX2 | TX2 | GND | +5V | TX0 | RX0
tNames: 3D Robotics Inc.